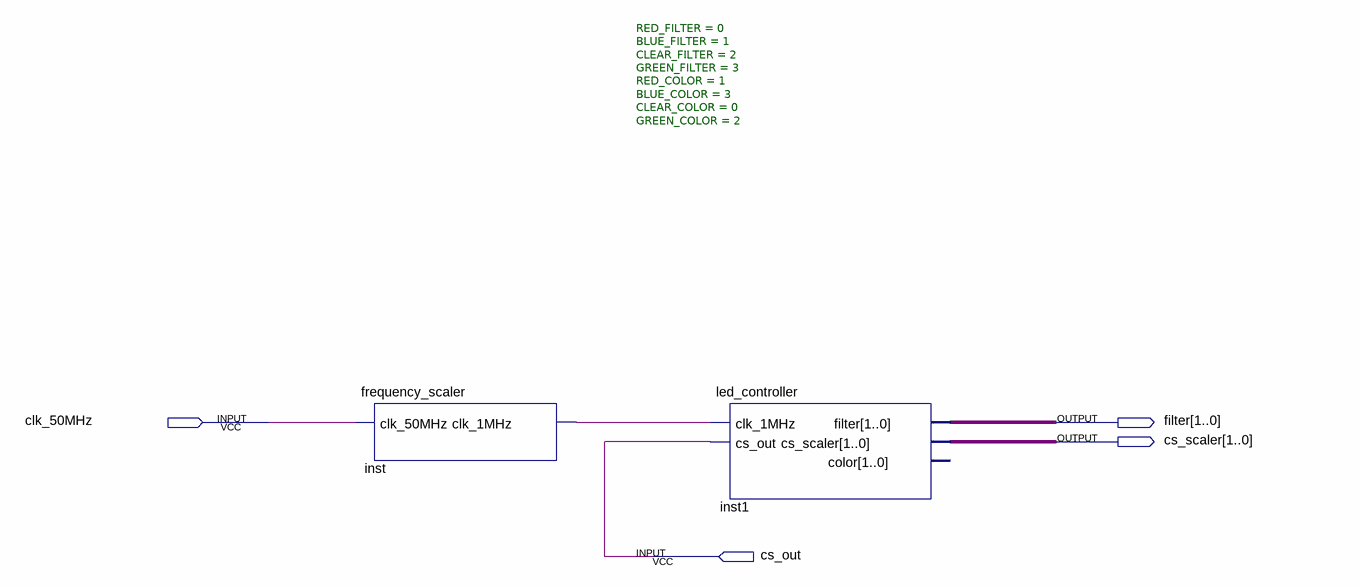
[diagram p0: schematic sheet]
// Quartus schematic CS_Tester.bdf as structural Verilog: 2 symbols, 4 pins
module CS_Tester (
  input  clk_50MHz,
  input  cs_out,
  output [1:0] filter,
  output [1:0] cs_scaler
);

  wire inst_clk_1mhz;

  frequency_scaler inst (.clk_50MHz(clk_50MHz), .clk_1MHz(inst_clk_1mhz));
  led_controller #(.RED_FILTER(0), .BLUE_FILTER(1), .CLEAR_FILTER(2), .GREEN_FILTER(3), .RED_COLOR(1), .BLUE_COLOR(3), .CLEAR_COLOR(0), .GREEN_COLOR(2)) inst1 (
    .clk_1MHz(inst_clk_1mhz), .cs_out(cs_out), .filter(filter), .cs_scaler(cs_scaler));  // open: color
endmodule
